# Altium schematic sheet Power.SchDoc
size A3; SheetNumber: 7; SheetTotal: 10
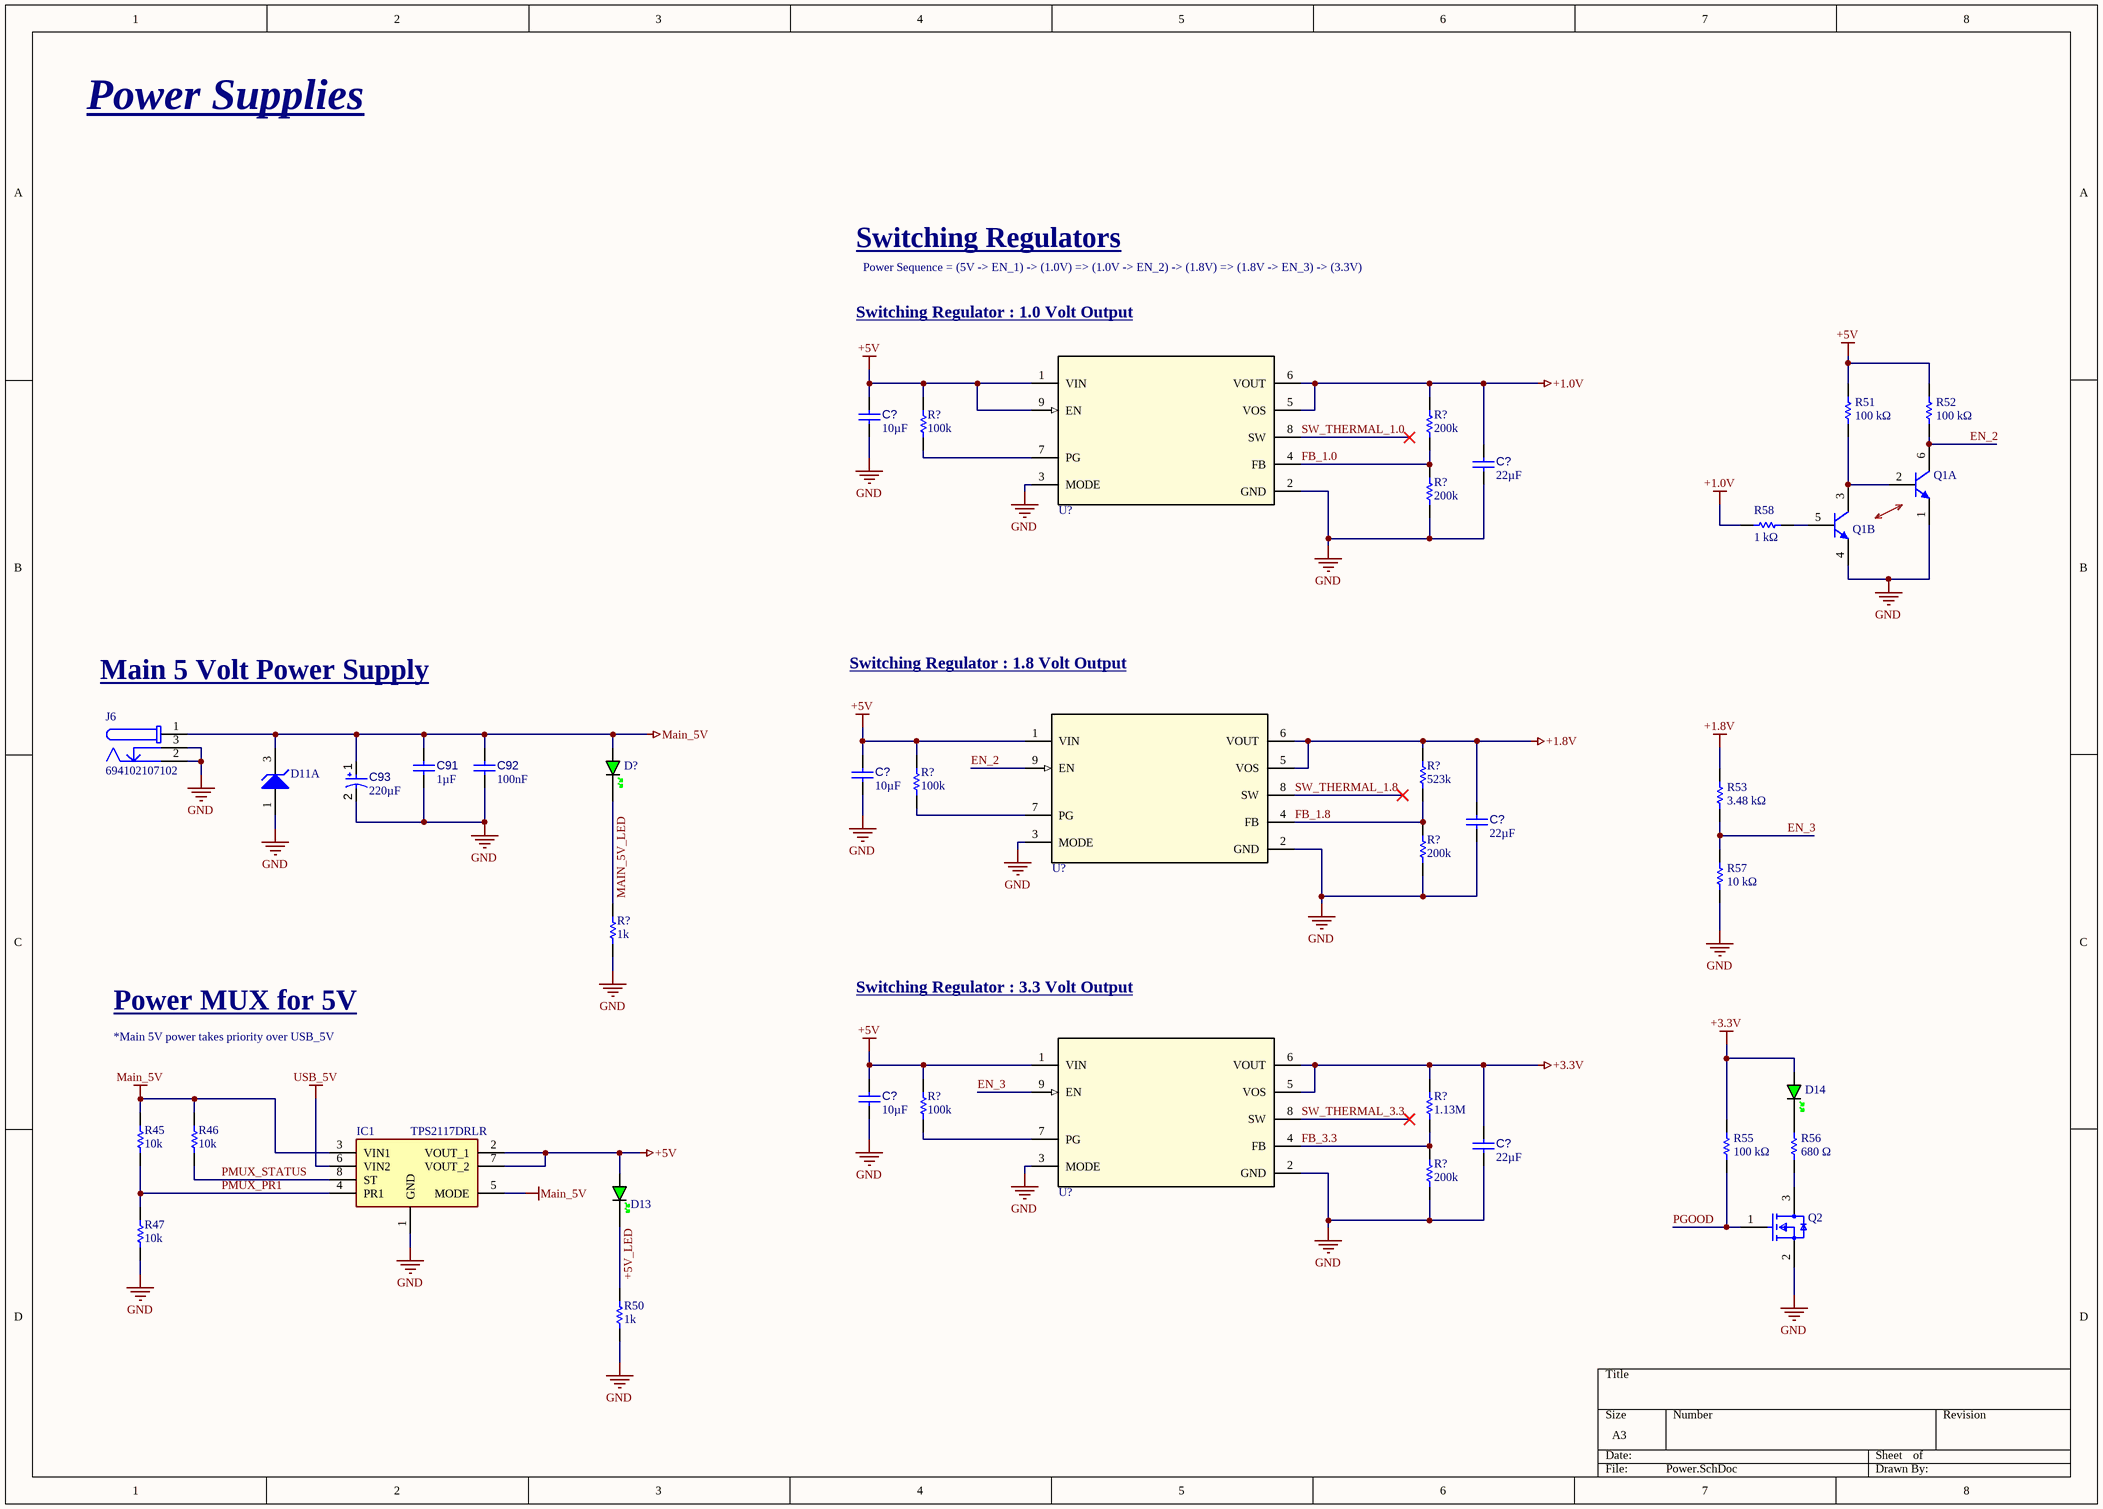
[diagram p0: Power.SchDoc]

## Parts
(Parts that share a designator on the sheet are numbered #1, #2 ... from top to bottom, then left to right.)
C91  value 1µF  [CAPC3216X180X20ML20]  (hidden comment: Capacitor 1 uF +/- 10% 25 V 1206)
C92  value 100nF  [CAPC1608X90X40NL10T20]  (hidden comment: Capacitor 100 nF +/-10% 50 V 0603)
C93  value 220µF  [CAPMP7344X31-T_V]  (hidden comment: TPSD227K010R0150)
C?#1  value 10µF  [FP-C0805C-DG-IPC_A]  (hidden comment: C0805C106K8PACTU)
C?#2  value 22µF  [CAPC0805(2012)145_L]  (hidden comment: Capacitor 22µF +/-40% 16V 0805)
C?#3  value 10µF  [FP-C0805C-DG-IPC_A]  (hidden comment: C0805C106K8PACTU)
C?#4  value 22µF  [CAPC0805(2012)145_L]  (hidden comment: Capacitor 22µF +/-40% 16V 0805)
C?#5  value 10µF  [FP-C0805C-DG-IPC_A]  (hidden comment: C0805C106K8PACTU)
C?#6  value 22µF  [CAPC0805(2012)145_L]  (hidden comment: Capacitor 22µF +/-40% 16V 0805)
D11  SZBZX84C5V6ET1G  [ONSC-SOT-23-3-318-08_V]  (value not drawn)  (part A of 2)
D13  LED_0402_GREEN  [LED_0402_GREEN]  (value not drawn)
D14  LED_0402_GREEN  [LED_0402_GREEN]  (value not drawn)
D?  LED_0402_GREEN  [LED_0402_GREEN]  (value not drawn)
IC1  TPS2117DRLR  [SOTFL50P160X60-8N]
J6  694102107102  [694102107102]
Q1  SMBT3904DW1T1G  [ONSC-SOT-363-6-419B-02_W_V]  (value not drawn)  (parts A,B of 2)
Q2  BSS138  [FP-318-08-IPC_B]  (value not drawn)
R45  value 10k  [RESC1608X55X25ML10T15]  (hidden comment: Resistor 10k +/-1% 0603 100 mW)
R46  value 10k  [RESC1608X55X25ML10T15]  (hidden comment: Resistor 10k +/-1% 0603 100 mW)
R47  value 10k  [RESC1608X55X25ML10T15]  (hidden comment: Resistor 10k +/-1% 0603 100 mW)
R50  value 1k  [RESC1005X40X25ML05T05]  (hidden comment: Resistor 1k +/-1% 0402 63 mW)
R51  Resistance: 100 kΩ  [RESC1608X55X25ML10T15]  (hidden comment: RC0603JR-070RL)
R52  Resistance: 100 kΩ  [RESC1608X55X25ML10T15]  (hidden comment: RC0603JR-070RL)
R53  Resistance: 3.48 kΩ  [RESC1608X55X25ML10T15]  (hidden comment: RC0603JR-070RL)
R55  Resistance: 100 kΩ  [RESC1608X55X25ML10T15]  (hidden comment: RC0603JR-070RL)
R56  Resistance: 680 Ω  [RESC1608X55X25ML10T15]  (hidden comment: RC0603JR-070RL)
R57  Resistance: 10 kΩ  [RESC1608X55X25ML10T15]  (hidden comment: RC0603JR-070RL)
R58  Resistance: 1 kΩ  [RESC1608X55X25ML10T15]  (hidden comment: RC0603JR-070RL)
R?#1  value 100k  [RESC1005X40X25ML05T05]  (hidden comment: Resistor 1k +/-1% 0402 63 mW)
R?#2  value 200k  [RESC0402(1005)_L]  (hidden comment: Resistor 200K +/-1 % 0402 63 mW)
R?#3  value 200k  [RESC0402(1005)_L]  (hidden comment: Resistor 200K +/-1 % 0402 63 mW)
R?#4  value 523k  [RESC1005X40X25LL10T10]  (hidden comment: CR0402-FX-5233GLF)
R?#5  value 100k  [RESC1005X40X25ML05T05]  (hidden comment: Resistor 1k +/-1% 0402 63 mW)
R?#6  value 200k  [RESC0402(1005)_L]  (hidden comment: Resistor 200K +/-1 % 0402 63 mW)
R?#7  value 1k  [RESC1005X40X25ML05T05]  (hidden comment: Resistor 1k +/-1% 0402 63 mW)
R?#8  value 100k  [RESC1005X40X25ML05T05]  (hidden comment: Resistor 1k +/-1% 0402 63 mW)
R?#9  value 1.13M  [RESC1005X40X25NL05T05]  (hidden comment: CRCW04021M13FKED)
R?#10  value 200k  [RESC0402(1005)_L]  (hidden comment: Resistor 200K +/-1 % 0402 63 mW)
U?#1  XPSM828303ARDSR  [RDS0009A-MFG]  (value not drawn)
U?#2  XPSM828303ARDSR  [RDS0009A-MFG]  (value not drawn)
U?#3  XPSM828303ARDSR  [RDS0009A-MFG]  (value not drawn)

## Nets
+1.0V: C?#2.2 R58.2 R?#2.2 U?#1.5(VOS) U?#1.6(VOUT)
+1.8V: C?#4.2 R53.1 R?#4.2 U?#2.5(VOS) U?#2.6(VOUT)
+3.3V: C?#6.2 D14.A R55.1 R?#9.2 U?#3.5(VOS) U?#3.6(VOUT)
+5V: C?#1.2 C?#3.2 C?#5.2 D13.A IC1.2(VOUT_1) IC1.7(VOUT_2) R51.2 R52.2 R?#1.2 R?#5.2 R?#8.2 U?#1.1(VIN) U?#1.9(EN) U?#2.1(VIN) U?#3.1(VIN)
GND: C91.1 C92.1 C93.2 C?#1.1 C?#2.1 C?#3.1 C?#4.1 C?#5.1 C?#6.1 D11.1(A) IC1.1(GND) J6.2 J6.3 Q1.1(E) Q1.4(E) Q2.2(S) R47.2 R50.1 R57.2 R?#3.1 R?#6.1 R?#7.2 R?#10.1 U?#1.2(GND) U?#1.3(MODE) U?#2.2(GND) U?#2.3(MODE) U?#3.2(GND) U?#3.3(MODE)
Main_5V: C91.2 C92.2 C93.1 D11.3(K) D?.A IC1.3(VIN1) IC1.5(MODE) J6.1 R45.1 R46.2
USB_5V: IC1.6(VIN2)
+5V_LED: D13.K R50.2
EN_2: Q1.6(C) R52.1 U?#2.9(EN)
EN_3: R53.2 R57.1 U?#3.9(EN)
FB_1.0: R?#2.1 R?#3.2 U?#1.4(FB)
FB_1.8: R?#4.1 R?#6.2 U?#2.4(FB)
FB_3.3: R?#9.1 R?#10.2 U?#3.4(FB)
MAIN_5V_LED: D?.K R?#7.1
PGOOD: Q2.1(G) R55.2
PMUX_PR1: IC1.4(PR1) R45.2 R47.1
PMUX_STATUS: IC1.8(ST) R46.1
SW_THERMAL_1.0: U?#1.8(SW)
SW_THERMAL_1.8: U?#2.8(SW)
SW_THERMAL_3.3: U?#3.8(SW)
NetQ1_2: Q1.2(B) Q1.3(C) R51.1
NetQ1_5: Q1.5(B) R58.1
NetQ2_3: Q2.3(D) R56.2
NetR?#1_1: R?#1.1 U?#1.7(PG)
NetR?#5_1: R?#5.1 U?#2.7(PG)
NetR?#8_1: R?#8.1 U?#3.7(PG)

Not connected (* = marked no-connect by the designer): D14 K; R56 1

## Notes on the sheet
- Power Supplies
- Switching Regulator : 1.0 Volt Output
- Switching Regulators
- Power Sequence = (5V -> EN_1) -> (1.0V) => (1.0V -> EN_2) -> (1.8V) => (1.8V -> EN_3) -> (3.3V)
- Main 5 Volt Power Supply
- Switching Regulator : 1.8 Volt Output
- Switching Regulator : 3.3 Volt Output
- Power MUX for 5V
- *Main 5V power takes priority over USB_5V

## Library data of the parts
C91 = CMP-001-00006-7: Chip Capacitor, 1 uF, +/- 10%, 25 V, 1206 (3216 Metric); Voltage Rating: 25V; Capacitor Type: Ceramic; Mounting Technology: SM; Case/Package: 1206; Max Operating Temperature: 125°C; RoHS Compliant: True; Tolerance: 10%; Pins: 2; Min Operating Temperature: -55°C
C92 = CMP-001-00017-7: Chip Capacitor, 100 nF, +/- 10%, 50 V, 0603 (1608 Metric); Voltage Rating: 50V; Capacitor Type: Ceramic; Mounting Technology: SM; Pins: 2; Tolerance: 10%; Case/Package: 0603; Max Operating Temperature: 125°C; Min Operating Temperature: -55°C; RoHS Compliant: True
C93 = CMP-001-00051-7: Tantalum Capacitor, 220 uF, +/- 10%, 10 V, -55 to 125 degC, 2917 (7343 Metric), RoHS, Tape and Reel; Manufacturer: AVX Corporation; Voltage Rating: 10V; Case/Package: 2917; Datasheet URL: https://datasheet.ciiva.com/8080/1680477-8080379.pdf; Package Description: 2-Pin Surface Mount Device, Body 7.3 x 4.35 mm; Tolerance: 10%; RoHS Compliant: True; Capacitor Type: Tantalum; Manufacturer URL: http://www.avx.com/; Pins: 2; Package Quantity: 1; Max Operating Temperature: 125°C; Mounting Technology: SM; Packaging: TapeandReel; Datasheet Version: 42736; Package Reference: 7343-31; Min Operating Temperature: -55°C
C?#1 C?#3 C?#5 = CMP-001-00111-1: 10V 10uF X5R ±10% 0805 Multilayer Ceramic Capacitors MLCC - SMD/SMT ROHS; Min Operating Temperature: -55°C; Pins: 2; Tolerance: 10%; Mounting Technology: Surface Mount; Voltage Rating: 10V; Case/Package: 0805; Max Operating Temperature: 85°C
C?#2 C?#4 C?#6 = CMP-001-00081-5: Chip Capacitor, 22µF +/-40%, 16V, 0805, Thickness 1.45 mm; Tolerance: 5%; Min Operating Temperature: -55°C; Pins: 2; Case/Package: 0805; Voltage Rating: 16V; Mounting Technology: SMT; Max Operating Temperature: 85°C
D11 = CMP-1060-00968-1: Zener Voltage Regulator, 225 mW, 3-Pin SOT-23, Pb-Free, Tape and Reel; Manufacturer: On Semiconductor; RoHS: Pb-Free; ComponentLink2URL: http://www.onsemi.com/pub_link/Collateral/BZX84C2V4ET1-D.PDF; ComponentLink1Description: Manufacturer URL; ComponentLink1URL: http://www.onsemi.com/; Mounting Technology: Surface Mount; PartNumber: SZBZX84C5V6ET1G; ComponentLink3Description: Package Specification; PackageDescription: 3-Pin Small Outline Transistor, Body 2.92 x 1.3 mm, Pitch 0.95 mm; ComponentLink2Description: Datasheet; ComponentLink3URL: http://www.onsemi.cn/pub_link/Collateral/318-08.PDF; DatasheetVersion: Rev. 8; PackageVersion: Rev. AP, 11/2009; PackageReference: SOT-23-3-318-08; Packing: Tape and Reel
D13 D14 D? = CMP-004-00056-2: LED 0402 GREEN SMD; Design Item ID: LED_0402_GREEN
IC1 = TPS2117DRLR: Integrated Circuit; Manufacturer_Name: Texas Instruments; Datasheet Link: https://www.ti.com/lit/ds/symlink/tps2117.pdf?ts=1704705133749&ref_url=https%253A%252F%252Fwww.ti.com%252Fproduct%252FTPS2117; Height: 0.6mm; Manufacturer_Part_Number: TPS2117DRLR; Mouser Part Number: 595-TPS2117DRLR; Mouser Price/Stock: https://www.mouser.co.uk/ProductDetail/Texas-Instruments/TPS2117DRLR?qs=HoCaDK9Nz5c%2FKe5lpCPPWQ%3D%3D; Arrow Part Number: TPS2117DRLR; Arrow Price/Stock: https://www.arrow.com/en/products/tps2117drlr/texas-instruments?region=nac
J6 = CMP-002-00073-1: CIRCULAR DC POWER CONNECTOR; Connector Type: Circular,Power; RoHS Compliant: Yes
Q1 = CMP-1048-00884-1: Dual General Purpose Transistors, 6-Pin SOT-363, Pb-Free, Tape and Reel; Manufacturer: On Semiconductor; fT Min (MHz): 300; Polarity: Dual NPN; IC Continuous (A): 0.2; Packing: Tape and Reel; DatasheetVersion: Rev. 9; PackageDescription: 6-Pin Small Outline Transistor, Body 2 x 1.25 mm, Pitch 0.65 mm; PartNumber: SMBT3904DW1T1G; ComponentLink1Description: Manufacturer URL; ComponentLink3URL: http://www.onsemi.com/pub_link/Collateral/NTJD4001N-D.PDF; RoHS: TRUE; ComponentLink1URL: http://www.onsemi.com/; Mounting Technology: Surface Mount; ComponentLink2Description: Datasheet; PackageVersion: Rev. W, 01/2006; ComponentLink3Description: Package Specification; PackageReference: SOT-363-6-419B-02_W; ComponentLink2URL: http://www.onsemi.com/pub_link/Collateral/MBT3904DW1T1-D.PDF
Q2 = CMP-07173-000101-1: MOSFET N-CH 50V 220MA SOT-23; Turn-Off Delay Time: 20ns; Element Configuration: Single; Rds On Max: 3.5R; Gate to Source Voltage (Vgs): 20V; Threshold Voltage: 1.3V; Number of Elements: 1; Power Dissipation: 360mW; Rise Time: 9ns; Turn-On Delay Time: 2.5ns; Input Capacitance: 27pF; On-State Resistance: 6R; Lead Free: Lead Free; Length: 2.92mm; Width: 1.3mm; Drain to Source Breakdown Voltage: 50V; Min Operating Temperature: -55°C; REACH SVHC: No SVHC; Packaging: Tape and Reel; Radiation Hardening: No; Height: 0.93mm; Drain to Source Voltage (Vdss): 50V; Current Rating: 220mA; Voltage Rating (DC): 50V; Weight: 0.03g; Continuous Drain Current (ID): 220mA; Number of Pins: 3; Nominal Vgs: 1.3V; Max Power Dissipation: 360mW; Fall Time: 9ns; Drain to Source Resistance: 3.5R; Contact Plating: Tin; Case/Package: SOT-23; Package Quantity: 1; Dual Supply Voltage: 50V; Mount: Surface Mount; Termination: SMD/SMT; Max Operating Temperature: 150°C
R45-R47 = CMP-009-00017-6: Chip Resistor, 10 KOhm, +/- 1%, 01 W, -55 to 155 degC, 0603 (1608 Metric); Power: 100mW; Voltage Rating: 50V; Tolerance: 1%; Case/Package: 0603; Min Operating Temperature: -55°C; RoHS Compliant: True; Mounting Technology: SM; Max Operating Temperature: 155°C; Pins: 2
R50 R?#1 R?#5 R?#7 R?#8 = CMP-009-00012-6: Chip Resistor, 1 KOhm, +/- 1%, 63 mW, -55 to 155 degC, 0402 (1005 Metric); Power: 63mW; Pins: 2; Min Operating Temperature: -55°C; Tolerance: 1%; Mounting Technology: SM; Case/Package: 0402; RoHS Compliant: True; Max Operating Temperature: 155°C
R51-R53 R55-R58 = CMP-2100-03667-1: Chip Resistor, 0 Ohm, +/- 5%, 0.1 W, -55 to 155 degC, 0603 (1608 Metric), RoHS, Tape and Reel; Manufacturer: Yageo; Temperature Coefficient: 200ppm/degreesC; Voltage Rating: 50V; Power Rating: 100mW; Width: 0.8mm; Max Operating Temperature: 155degC; Tolerance: 5%; Package Reference: 0603; Height: 0.45mm; Depth: 0.8mm; Package Description: 2-Pin Surface Mount Device, Body 1.6 x 0.8 mm; Termination: SMD/SMT; Package Quantity: 5000; Case/Package: 0603; Case Code (Imperial): 0603; Radiation Hardening: No; Number of Pins: 2; Length: 1.6mm; Lead Free: LeadFree; Voltage Rating (DC): 50V; Military Standard: Not; Datasheet URL: http://www.yageo.com/NewPortal/yageodocoutput?fileName=/pdf/R-Chip/PYu-RC_Group_51_RoHS_L_5.pdf; Manufacturer URL: http://www.yageo.com/; Packaging: TapeandReel; Case Code (Metric): 1608; Min Operating Temperature: -55degC; Composition: ThickFilm; RoHSCompliant: true; Contact Plating: Tin; Datasheet Version: Rev. 5, 10/2016; REACH SVHC: NoSVHC
R?#2 R?#3 R?#6 R?#10 = CMP-009-00163-4: Chip Resistor, 200 kOhms, +/-1 %, 63 mW, -55 to 155 degC, 0402; Tolerance: 1%; Power: 63mW; Min Operating Temperature: -55°C; Pins: 2; Max Operating Temperature: 155°C; Case/Package: 0402
R?#4 = CMP-009-00203-1: Res Thick Film 0402 523K Ohm 1% 1/16W 100ppm/C Molded SMD SMD Paper Tape on Plastic Reel; Voltage Rating: 50V; Max Operating Temperature: 155°C; Case/Package: 0402; Mounting Technology: Surface Mount; Tolerance: 1%; Min Operating Temperature: -55°C
R?#9 = CMP-009-00207-1: Res Thick Film 0402 1.13M Ohm 1% 0.063W(1/16W) ±100ppm/C Pad SMD T/R Automotive; Voltage Rating: 50V; Max Operating Temperature: 155°C; Pins: 2; Mounting Technology: Surface Mount; Case/Package: 0402; Tolerance: 1%; Min Operating Temperature: -55°C
U?#1-U?#3 = CMP-006-00049-1: 2.25-V to 5.5-V, 3-A, low-noise step-down module with integrated inductor in QFN package 9-QFN-FCMOD -40 to 125; Manufacturer_Name: Texas Instruments; Datasheet: https://www.ti.com/lit/gpn/tpsm828303; TYPE: TYPE; Copyright: Copyright (C) 2025 Ultra Librarian. All rights reserved.; Source: XPSM828303ARDSR.SchLib; Manufacturer_Part_Number: XPSM828303ARDSR; Design Item ID: XPSM828303ARDSR; RefDes: RefDes